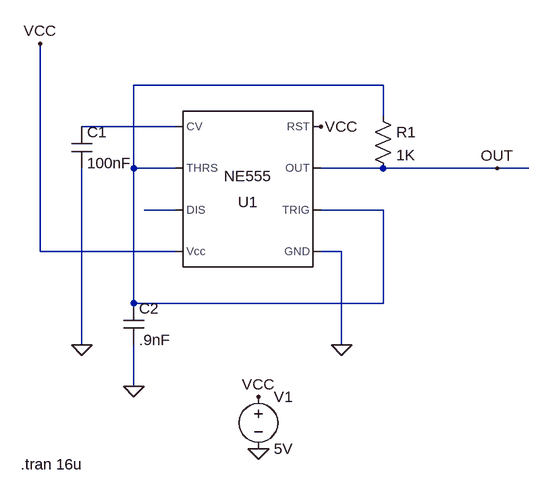
[diagram p0: schematic 555timer.asc]
555timer.asc, the LTspice schematic file:
Version 4
SHEET 1 880 680
WIRE 448 0 64 0
WIRE 448 48 448 0
WIRE 128 64 -16 64
WIRE 64 128 64 0
WIRE 128 128 64 128
WIRE 448 128 352 128
WIRE 624 128 448 128
WIRE 672 128 624 128
WIRE 128 192 80 192
WIRE 448 192 352 192
WIRE -80 256 -80 -64
WIRE 128 256 -80 256
WIRE 384 256 352 256
WIRE 64 336 64 128
WIRE 448 336 448 192
WIRE 448 336 64 336
WIRE -16 400 -16 128
WIRE 384 400 384 256
WIRE 64 464 64 400
FLAG -16 400 0
FLAG 384 400 0
FLAG -80 -64 VCC
FLAG 352 64 VCC
FLAG 64 464 0
FLAG 256 560 0
FLAG 256 480 VCC
FLAG 624 128 OUT
SYMBOL Misc\\NE555 240 160 R180
SYMATTR InstName U1
SYMBOL cap -32 64 R0
SYMATTR InstName C1
SYMATTR Value 100nF
SYMBOL res 432 32 R0
SYMATTR InstName R1
SYMATTR Value 1K
SYMBOL cap 48 336 R0
SYMATTR InstName C2
SYMATTR Value .9nF
SYMBOL voltage 256 464 R0
WINDOW 123 0 0 Left 2
WINDOW 39 0 0 Left 2
SYMATTR InstName V1
SYMATTR Value 5V
TEXT -110 584 Left 2 !.tran 16u

The netlist it stands for:
* 555timer.asc
XU1 0 N001 OUT VCC N002 N001 N003 VCC NE555  ; pins GND TRIG OUT RST CV THRS DIS Vcc
C1 N002 0 100nF
R1 N001 OUT 1K
C2 N001 0 .9nF
V1 VCC 0 5V
.tran 16u
.lib NE555.sub
.backanno
.end